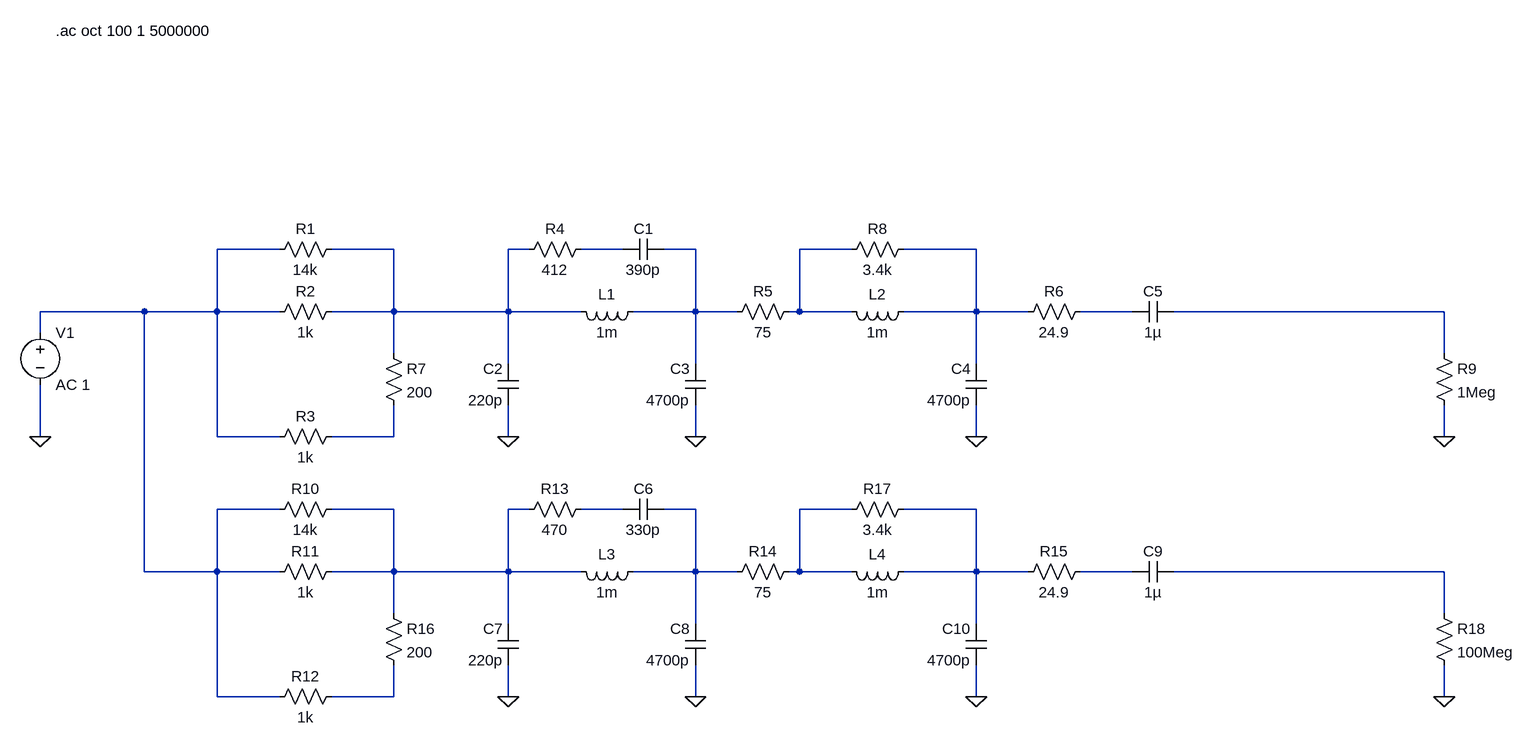
[diagram p0: schematic class-d-filter.asc]
class-d-filter.asc, the LTspice schematic file:
Version 4
SHEET 1 1952 784
WIRE 48 48 -48 48
WIRE 224 48 128 48
WIRE 432 48 400 48
WIRE 576 48 512 48
WIRE 688 48 640 48
WIRE 928 48 848 48
WIRE 1120 48 1008 48
WIRE -160 144 -320 144
WIRE -48 144 -48 48
WIRE -48 144 -160 144
WIRE 48 144 -48 144
WIRE 224 144 224 48
WIRE 224 144 128 144
WIRE 400 144 400 48
WIRE 400 144 224 144
WIRE 512 144 400 144
WIRE 688 144 688 48
WIRE 688 144 592 144
WIRE 752 144 688 144
WIRE 848 144 848 48
WIRE 848 144 832 144
WIRE 928 144 848 144
WIRE 1120 144 1120 48
WIRE 1120 144 1008 144
WIRE 1200 144 1120 144
WIRE 1360 144 1280 144
WIRE 1840 144 1424 144
WIRE -320 176 -320 144
WIRE 224 208 224 144
WIRE 1840 208 1840 144
WIRE 400 224 400 144
WIRE 688 224 688 144
WIRE 1120 224 1120 144
WIRE -320 336 -320 256
WIRE -48 336 -48 144
WIRE 48 336 -48 336
WIRE 224 336 224 288
WIRE 224 336 128 336
WIRE 400 336 400 288
WIRE 688 336 688 288
WIRE 1120 336 1120 288
WIRE 1840 336 1840 288
WIRE 48 448 -48 448
WIRE 224 448 128 448
WIRE 432 448 400 448
WIRE 576 448 512 448
WIRE 688 448 640 448
WIRE 928 448 848 448
WIRE 1120 448 1008 448
WIRE -160 544 -160 144
WIRE -48 544 -48 448
WIRE -48 544 -160 544
WIRE 48 544 -48 544
WIRE 224 544 224 448
WIRE 224 544 128 544
WIRE 400 544 400 448
WIRE 400 544 224 544
WIRE 512 544 400 544
WIRE 688 544 688 448
WIRE 688 544 592 544
WIRE 752 544 688 544
WIRE 848 544 848 448
WIRE 848 544 832 544
WIRE 928 544 848 544
WIRE 1120 544 1120 448
WIRE 1120 544 1008 544
WIRE 1200 544 1120 544
WIRE 1360 544 1280 544
WIRE 1840 544 1424 544
WIRE 224 608 224 544
WIRE 1840 608 1840 544
WIRE 400 624 400 544
WIRE 688 624 688 544
WIRE 1120 624 1120 544
WIRE -48 736 -48 544
WIRE 48 736 -48 736
WIRE 224 736 224 688
WIRE 224 736 128 736
WIRE 400 736 400 688
WIRE 688 736 688 688
WIRE 1120 736 1120 688
WIRE 1840 736 1840 688
FLAG 400 336 0
FLAG 688 336 0
FLAG 1120 336 0
FLAG -320 336 0
FLAG 1840 336 0
FLAG 400 736 0
FLAG 688 736 0
FLAG 1120 736 0
FLAG 1840 736 0
SYMBOL res 144 32 R90
WINDOW 0 0 56 VBottom 2
WINDOW 3 32 56 VTop 2
SYMATTR InstName R1
SYMATTR Value 14k
SYMATTR SpiceLine tol=1 pwr=0.25
SYMBOL res 144 128 R90
WINDOW 0 0 56 VBottom 2
WINDOW 3 32 56 VTop 2
SYMATTR InstName R2
SYMATTR Value 1k
SYMATTR SpiceLine tol=1 pwr=5
SYMBOL res 144 320 R90
WINDOW 0 0 56 VBottom 2
WINDOW 3 32 56 VTop 2
SYMATTR InstName R3
SYMATTR Value 1k
SYMATTR SpiceLine tol=1 pwr=5
SYMBOL res 528 32 R90
WINDOW 0 0 56 VBottom 2
WINDOW 3 32 56 VTop 2
SYMATTR InstName R4
SYMATTR Value 412
SYMBOL res 848 128 R90
WINDOW 0 0 56 VBottom 2
WINDOW 3 32 56 VTop 2
SYMATTR InstName R5
SYMATTR Value 75
SYMATTR SpiceLine tol=1
SYMBOL res 1296 128 R90
WINDOW 0 0 56 VBottom 2
WINDOW 3 32 56 VTop 2
SYMATTR InstName R6
SYMATTR Value 24.9
SYMBOL cap 640 32 R90
WINDOW 0 0 32 VBottom 2
WINDOW 3 32 32 VTop 2
SYMATTR InstName C1
SYMATTR Value 390p
SYMATTR SpiceLine V=630
SYMBOL cap 416 288 R180
WINDOW 0 24 56 Left 2
WINDOW 3 24 8 Left 2
SYMATTR InstName C2
SYMATTR Value 220p
SYMATTR SpiceLine V=400
SYMBOL cap 704 288 R180
WINDOW 0 24 56 Left 2
WINDOW 3 24 8 Left 2
SYMATTR InstName C3
SYMATTR Value 4700p
SYMATTR SpiceLine V=630
SYMBOL cap 1424 128 R90
WINDOW 0 0 32 VBottom 2
WINDOW 3 32 32 VTop 2
SYMATTR InstName C5
SYMATTR Value 1µ
SYMBOL res 208 192 R0
SYMATTR InstName R7
SYMATTR Value 200
SYMATTR SpiceLine tol=1
SYMBOL ind 608 128 R90
WINDOW 0 5 56 VBottom 2
WINDOW 3 32 56 VTop 2
SYMATTR InstName L1
SYMATTR Value 1m
SYMBOL ind 1024 128 R90
WINDOW 0 5 56 VBottom 2
WINDOW 3 32 56 VTop 2
SYMATTR InstName L2
SYMATTR Value 1m
SYMBOL res 1024 32 R90
WINDOW 0 0 56 VBottom 2
WINDOW 3 32 56 VTop 2
SYMATTR InstName R8
SYMATTR Value 3.4k
SYMATTR SpiceLine tol=1 pwr=0.25
SYMBOL cap 1136 288 R180
WINDOW 0 24 56 Left 2
WINDOW 3 24 8 Left 2
SYMATTR InstName C4
SYMATTR Value 4700p
SYMATTR SpiceLine V=630
SYMBOL voltage -320 160 R0
WINDOW 123 0 0 Left 0
WINDOW 39 0 0 Left 0
SYMATTR InstName V1
SYMATTR Value AC 1
SYMBOL res 1824 192 R0
SYMATTR InstName R9
SYMATTR Value 1Meg
SYMBOL res 144 432 R90
WINDOW 0 0 56 VBottom 2
WINDOW 3 32 56 VTop 2
SYMATTR InstName R10
SYMATTR Value 14k
SYMATTR SpiceLine tol=1 pwr=0.25
SYMBOL res 144 528 R90
WINDOW 0 0 56 VBottom 2
WINDOW 3 32 56 VTop 2
SYMATTR InstName R11
SYMATTR Value 1k
SYMATTR SpiceLine tol=1 pwr=5
SYMBOL res 144 720 R90
WINDOW 0 0 56 VBottom 2
WINDOW 3 32 56 VTop 2
SYMATTR InstName R12
SYMATTR Value 1k
SYMATTR SpiceLine tol=1 pwr=5
SYMBOL res 528 432 R90
WINDOW 0 0 56 VBottom 2
WINDOW 3 32 56 VTop 2
SYMATTR InstName R13
SYMATTR Value 470
SYMBOL res 848 528 R90
WINDOW 0 0 56 VBottom 2
WINDOW 3 32 56 VTop 2
SYMATTR InstName R14
SYMATTR Value 75
SYMATTR SpiceLine tol=1
SYMBOL res 1296 528 R90
WINDOW 0 0 56 VBottom 2
WINDOW 3 32 56 VTop 2
SYMATTR InstName R15
SYMATTR Value 24.9
SYMBOL cap 640 432 R90
WINDOW 0 0 32 VBottom 2
WINDOW 3 32 32 VTop 2
SYMATTR InstName C6
SYMATTR Value 330p
SYMATTR SpiceLine V=630
SYMBOL cap 416 688 R180
WINDOW 0 24 56 Left 2
WINDOW 3 24 8 Left 2
SYMATTR InstName C7
SYMATTR Value 220p
SYMATTR SpiceLine V=400
SYMBOL cap 704 688 R180
WINDOW 0 24 56 Left 2
WINDOW 3 24 8 Left 2
SYMATTR InstName C8
SYMATTR Value 4700p
SYMATTR SpiceLine V=630
SYMBOL cap 1424 528 R90
WINDOW 0 0 32 VBottom 2
WINDOW 3 32 32 VTop 2
SYMATTR InstName C9
SYMATTR Value 1µ
SYMBOL res 208 592 R0
SYMATTR InstName R16
SYMATTR Value 200
SYMATTR SpiceLine tol=1
SYMBOL ind 608 528 R90
WINDOW 0 5 56 VBottom 2
WINDOW 3 32 56 VTop 2
SYMATTR InstName L3
SYMATTR Value 1m
SYMATTR SpiceLine Rser=3
SYMBOL ind 1024 528 R90
WINDOW 0 5 56 VBottom 2
WINDOW 3 32 56 VTop 2
SYMATTR InstName L4
SYMATTR Value 1m
SYMATTR SpiceLine Rser=3
SYMBOL res 1024 432 R90
WINDOW 0 0 56 VBottom 2
WINDOW 3 32 56 VTop 2
SYMATTR InstName R17
SYMATTR Value 3.4k
SYMATTR SpiceLine tol=1 pwr=0.25
SYMBOL cap 1136 688 R180
WINDOW 0 24 56 Left 2
WINDOW 3 24 8 Left 2
SYMATTR InstName C10
SYMATTR Value 4700p
SYMATTR SpiceLine V=630
SYMBOL res 1824 592 R0
SYMATTR InstName R18
SYMATTR Value 100Meg
TEXT -296 -288 Left 2 !.ac oct 100 1 5000000

The netlist it stands for:
* class-d-filter.asc
R1 N002 N001 14k tol=1 pwr=0.25
R2 N002 N001 1k tol=1 pwr=5
R3 N009 N001 1k tol=1 pwr=5
R4 N003 N002 412
R5 N005 N004 75 tol=1
R6 N007 N006 24.9
C1 N004 N003 390p V=630
C2 0 N002 220p V=400
C3 0 N004 4700p V=630
C5 N008 N007 1µ
R7 N002 N009 200 tol=1
L1 N004 N002 1m
L2 N006 N005 1m
R8 N006 N005 3.4k tol=1 pwr=0.25
C4 0 N006 4700p V=630
V1 N001 0 AC 1
R9 N008 0 1Meg
R10 N010 N001 14k tol=1 pwr=0.25
R11 N010 N001 1k tol=1 pwr=5
R12 N017 N001 1k tol=1 pwr=5
R13 N011 N010 470
R14 N013 N012 75 tol=1
R15 N015 N014 24.9
C6 N012 N011 330p V=630
C7 0 N010 220p V=400
C8 0 N012 4700p V=630
C9 N016 N015 1µ
R16 N010 N017 200 tol=1
L3 N012 N010 1m Rser=3
L4 N014 N013 1m Rser=3
R17 N014 N013 3.4k tol=1 pwr=0.25
C10 0 N014 4700p V=630
R18 N016 0 100Meg
.ac oct 100 1 5000000
.backanno
.end